# EAGLE schematic Shield_schematic (EAGLE 8.4.0)
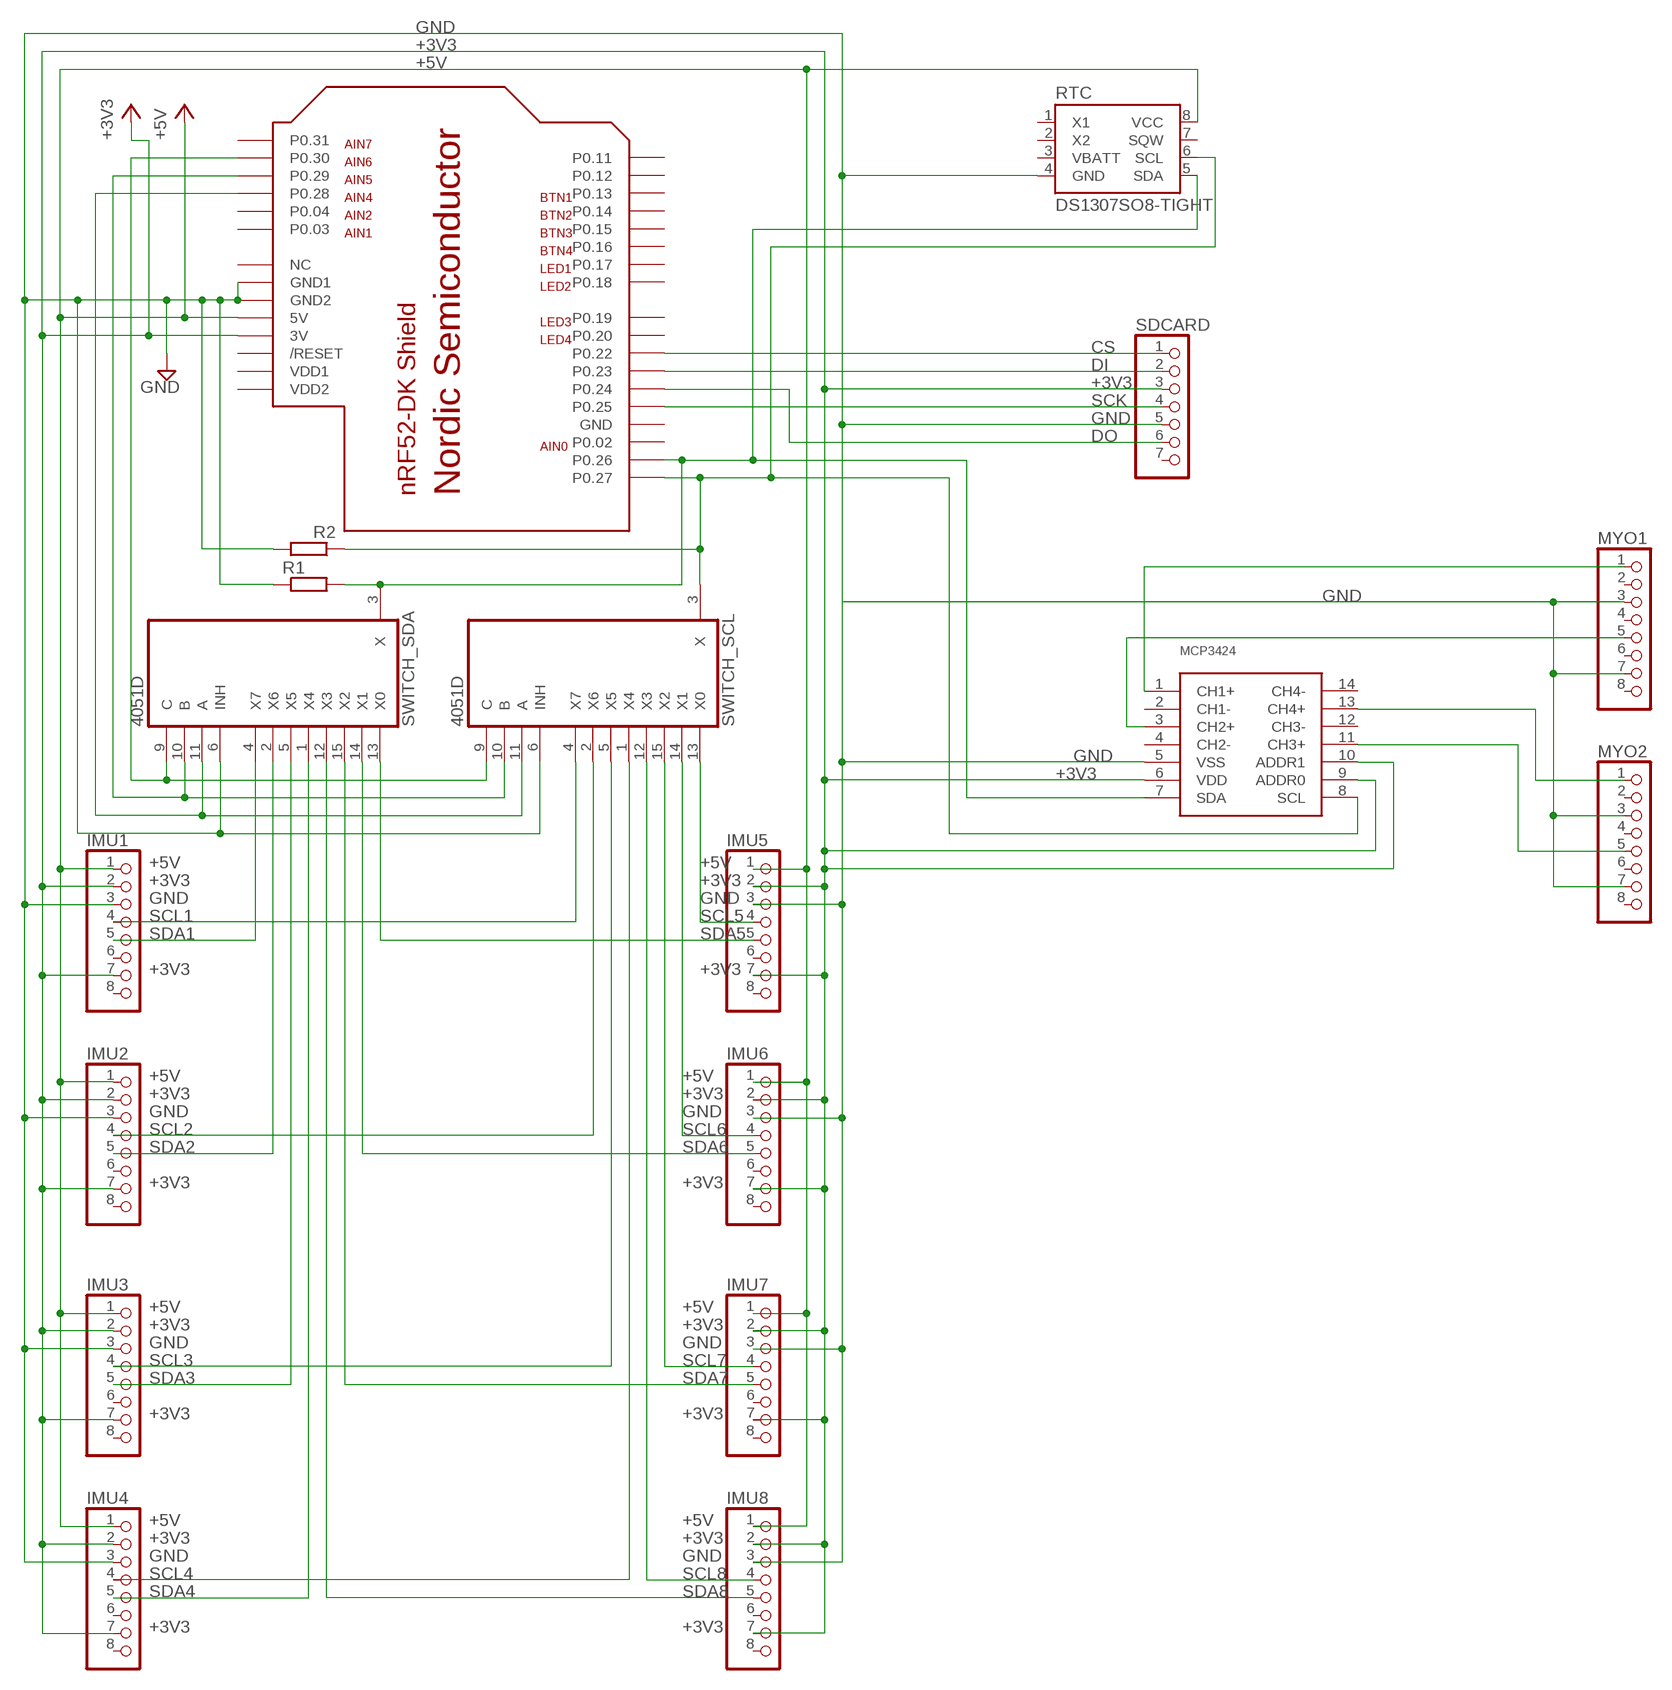
[diagram p0: schematic, sheet 1]

## Parts
IMU1  PINHD-1X8  [1X08]
IMU2  PINHD-1X8  [1X08]
IMU3  PINHD-1X8  [1X08]
IMU4  PINHD-1X8  [1X08]
IMU5  PINHD-1X8  [1X08]
IMU6  PINHD-1X8  [1X08]
IMU7  PINHD-1X8  [1X08]
IMU8  PINHD-1X8  [1X08]
MYO1  PINHD-1X8  [1X08]
MYO2  PINHD-1X8  [1X08]
R1  R-EU_0411/15  [0411/15]
R2  R-EU_0411/15  [0411/15]
RTC  DS1307SO8-TIGHT  [SO08-TIGHT]
SDCARD  PINHD-1X7  [1X07]
SWITCH_SCL  4051D  [SO16]
SWITCH_SDA  4051D  [SO16]
U$2  NRF52-SHIELD-NOTEXT  [NRF52-SHIELD]
U$3  MCP3424  [SO14]

## Nets
+3V3: IMU1.2 IMU1.7 IMU2.2 IMU2.7 IMU3.2 IMU3.7 IMU4.2 IMU4.7 IMU5.2 IMU5.7 IMU6.2 IMU6.7 IMU7.2 IMU7.7 IMU8.2 IMU8.7 SDCARD.3 U$2.3V U$3.6(VDD) U$3.9(ADDR0) U$3.10(ADDR1)
+5V: IMU1.1 IMU2.1 IMU3.1 IMU4.1 IMU5.1 IMU6.1 IMU7.1 IMU8.1 RTC.8(VCC) U$2.5V
CS: SDCARD.1 U$2.P22(P0.22)
DI: SDCARD.2 U$2.P23(P0.23)
DO: SDCARD.6 U$2.P24(P0.24)
GND: IMU1.3 IMU2.3 IMU3.3 IMU4.3 IMU5.3 IMU6.3 IMU7.3 IMU8.3 MYO1.3 MYO1.7 MYO2.3 MYO2.7 R1.1 R2.2 RTC.4(GND) SDCARD.5 SWITCH_SCL.6(INH) SWITCH_SDA.6(INH) U$2.GND1 U$2.GND2 U$3.5(VSS)
N$1: MYO1.1 U$3.1(CH1+)
N$2: MYO1.5 U$3.3(CH2+)
N$3: R2.1 RTC.6(SCL) SWITCH_SCL.3(X) U$2.P27(P0.27) U$3.8(SCL)
N$4: MYO2.1 U$3.13(CH4+)
N$5: MYO2.5 U$3.11(CH3+)
N$22: SWITCH_SCL.11(A) SWITCH_SDA.11(A) U$2.P28(P0.28)
N$23: R1.2 RTC.5(SDA) SWITCH_SDA.3(X) U$2.P26(P0.26) U$3.7(SDA)
N$25: SWITCH_SCL.10(B) SWITCH_SDA.10(B) U$2.P29(P0.29)
N$27: SWITCH_SCL.9(C) SWITCH_SDA.9(C) U$2.P30(P0.30)
SCK: SDCARD.4 U$2.P25(P0.25)
SCL1: IMU1.4 SWITCH_SCL.4(X7)
SCL2: IMU2.4 SWITCH_SCL.2(X6)
SCL3: IMU3.4 SWITCH_SCL.5(X5)
SCL4: IMU4.4 SWITCH_SCL.1(X4)
SCL5: IMU5.4 SWITCH_SCL.13(X0)
SCL6: IMU6.4 SWITCH_SCL.14(X1)
SCL7: IMU7.4 SWITCH_SCL.15(X2)
SCL8: IMU8.4 SWITCH_SCL.12(X3)
SDA1: IMU1.5 SWITCH_SDA.4(X7)
SDA2: IMU2.5 SWITCH_SDA.2(X6)
SDA3: IMU3.5 SWITCH_SDA.5(X5)
SDA4: IMU4.5 SWITCH_SDA.1(X4)
SDA5: IMU5.5 SWITCH_SDA.13(X0)
SDA6: IMU6.5 SWITCH_SDA.14(X1)
SDA7: IMU7.5 SWITCH_SDA.15(X2)
SDA8: IMU8.5 SWITCH_SDA.12(X3)
Unconnected: IMU1.6 IMU1.8 IMU2.6 IMU2.8 IMU3.6 IMU3.8 IMU4.6 IMU4.8 IMU5.6 IMU5.8 IMU6.6 IMU6.8 IMU7.6 IMU7.8 IMU8.6 IMU8.8 MYO1.2 MYO1.4 MYO1.6 MYO1.8 MYO2.2 MYO2.4 MYO2.6 MYO2.8 RTC.1(X1) RTC.2(X2) RTC.3(VBATT) RTC.7(SQW) SDCARD.7 U$2.NC U$2.P02(P0.02) U$2.P03(P0.03) U$2.P04(P0.04) U$2.P11(P0.11) U$2.P12(P0.12) U$2.P13(P0.13) U$2.P14(P0.14) U$2.P15(P0.15) U$2.P16(P0.16) U$2.P17(P0.17) U$2.P18(P0.18) U$2.P19(P0.19) U$2.P20(P0.20) U$2.P31(P0.31) U$2.RESET(/RESET) U$3.2(CH1-) U$3.4(CH2-) U$3.12(CH3-) U$3.14(CH4-)

## Power pins joined to a net without a drawn wire
GND: SWITCH_SCL.8(GND) SWITCH_SDA.8(GND) U$2.GND
VCC: SWITCH_SCL.16(VCC) SWITCH_SDA.16(VCC)
VDD1: U$2.VDD2(VDD1)
VDD2: U$2.VDD1(VDD2)
VEE: SWITCH_SCL.7(VEE) SWITCH_SDA.7(VEE)

## Library data of the parts
IMU1-IMU8 MYO1 MYO2 = pinhead:PINHD-1X8: PIN HEADER
R1 R2 = rcl:R-EU_: RESISTOR, European symbol
RTC = DS1307:DS1307: I2C real-time clock with battery backup.; AVAILABILITY: Unavailable; DESCRIPTION: IC RTC CLK/CALENDAR I2C 8-DIP; MF: Maxim Integrated; MP: DS1307; PACKAGE: DIP-8 Maxim Integrated; PRICE: 2.56 USD
SDCARD = pinhead:PINHD-1X7: PIN HEADER
SWITCH_SCL SWITCH_SDA = 40xx:4051: 8-channel ANALOG MULTIPLEXER
U$2 = nrf52-shield_modif:NRF52-SHIELD: nRF5 devkit shield
U$3 = mcp3424:MCP3424